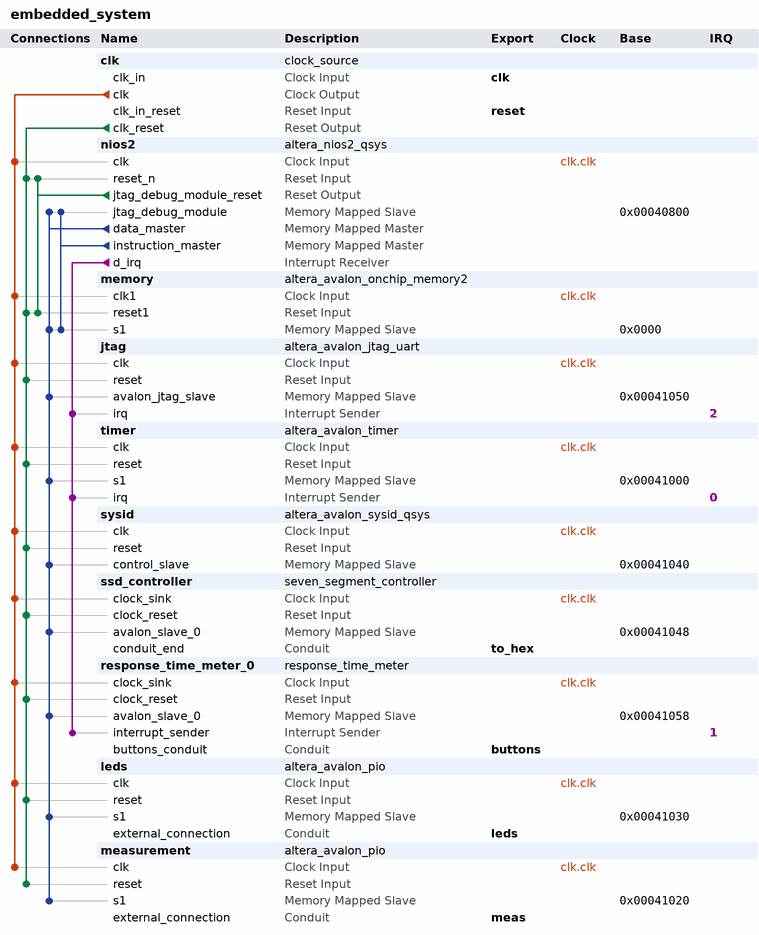
[diagram p0: system contents]
# Platform Designer (Qsys) system embedded_system, Cyclone V 5CSEMA5F31C6
# Parameters at their usual value, and those the tool derives, are not listed.
package require -exact qsys 18.1
create_system embedded_system
set_project_property DEVICE_FAMILY {Cyclone V}
set_project_property DEVICE 5CSEMA5F31C6

add_instance clk clock_source 18.1
set_instance_parameter_value clk clockFrequency 50000000

add_instance nios2 altera_nios2_qsys 16.1
set_instance_parameter_value nios2 breakSlave nios2.jtag_debug_module
set_instance_parameter_value nios2 exceptionSlave memory.s1
set_instance_parameter_value nios2 icache_size 4096
set_instance_parameter_value nios2 impl Tiny
set_instance_parameter_value nios2 mmu_TLBMissExcSlave None
set_instance_parameter_value nios2 resetSlave memory.s1
set_instance_parameter_value nios2 resetrequest_enabled true

add_instance memory altera_avalon_onchip_memory2 18.1
set_instance_parameter_value memory dataWidth 32
set_instance_parameter_value memory dualPort false
set_instance_parameter_value memory initMemContent true
set_instance_parameter_value memory initializationFileName onchip_mem.hex
set_instance_parameter_value memory memorySize 196608

add_instance jtag altera_avalon_jtag_uart 18.1
set_instance_parameter_value jtag simInteractiveOptions NO_INTERACTIVE_WINDOWS

add_instance timer altera_avalon_timer 18.1
set_instance_parameter_value timer alwaysRun true
set_instance_parameter_value timer fixedPeriod true
set_instance_parameter_value timer period 1
set_instance_parameter_value timer periodUnits MSEC
set_instance_parameter_value timer snapshot false

add_instance sysid altera_avalon_sysid_qsys 18.1
set_instance_parameter_value sysid id 19088743

add_instance ssd_controller seven_segment_controller 1.0

add_instance response_time_meter_0 response_time_meter 1.0

add_instance leds altera_avalon_pio 18.1
set_instance_parameter_value leds direction Output
set_instance_parameter_value leds width 10

add_instance measurement altera_avalon_pio 18.1
set_instance_parameter_value measurement direction Output
set_instance_parameter_value measurement width 10

# connections
add_connection clk.clk jtag.clk clock
add_connection clk.clk leds.clk clock
add_connection clk.clk measurement.clk clock
add_connection clk.clk memory.clk1 clock
add_connection clk.clk nios2.clk clock
add_connection clk.clk response_time_meter_0.clock_sink clock
add_connection clk.clk ssd_controller.clock_sink clock
add_connection clk.clk sysid.clk clock
add_connection clk.clk timer.clk clock
add_connection clk.clk_reset jtag.reset reset
add_connection clk.clk_reset leds.reset reset
add_connection clk.clk_reset measurement.reset reset
add_connection clk.clk_reset memory.reset1 reset
add_connection clk.clk_reset nios2.reset_n reset
add_connection clk.clk_reset response_time_meter_0.clock_reset reset
add_connection clk.clk_reset ssd_controller.clock_reset reset
add_connection clk.clk_reset sysid.reset reset
add_connection clk.clk_reset timer.reset reset
add_connection nios2.jtag_debug_module_reset memory.reset1 reset
add_connection nios2.jtag_debug_module_reset nios2.reset_n reset
add_connection nios2.data_master jtag.avalon_jtag_slave avalon
set_connection_parameter_value nios2.data_master/jtag.avalon_jtag_slave baseAddress 0x00041050
add_connection nios2.data_master leds.s1 avalon
set_connection_parameter_value nios2.data_master/leds.s1 baseAddress 0x00041030
add_connection nios2.data_master measurement.s1 avalon
set_connection_parameter_value nios2.data_master/measurement.s1 baseAddress 0x00041020
add_connection nios2.data_master memory.s1 avalon
set_connection_parameter_value nios2.data_master/memory.s1 baseAddress 0x0000
add_connection nios2.data_master nios2.jtag_debug_module avalon
set_connection_parameter_value nios2.data_master/nios2.jtag_debug_module baseAddress 0x00040800
add_connection nios2.data_master response_time_meter_0.avalon_slave_0 avalon
set_connection_parameter_value nios2.data_master/response_time_meter_0.avalon_slave_0 baseAddress 0x00041058
add_connection nios2.data_master ssd_controller.avalon_slave_0 avalon
set_connection_parameter_value nios2.data_master/ssd_controller.avalon_slave_0 baseAddress 0x00041048
add_connection nios2.data_master sysid.control_slave avalon
set_connection_parameter_value nios2.data_master/sysid.control_slave baseAddress 0x00041040
add_connection nios2.data_master timer.s1 avalon
set_connection_parameter_value nios2.data_master/timer.s1 baseAddress 0x00041000
add_connection nios2.instruction_master memory.s1 avalon
set_connection_parameter_value nios2.instruction_master/memory.s1 baseAddress 0x0000
add_connection nios2.instruction_master nios2.jtag_debug_module avalon
set_connection_parameter_value nios2.instruction_master/nios2.jtag_debug_module baseAddress 0x00040800
add_connection nios2.d_irq jtag.irq interrupt
set_connection_parameter_value nios2.d_irq/jtag.irq irqNumber 2
add_connection nios2.d_irq response_time_meter_0.interrupt_sender interrupt
set_connection_parameter_value nios2.d_irq/response_time_meter_0.interrupt_sender irqNumber 1
add_connection nios2.d_irq timer.irq interrupt
set_connection_parameter_value nios2.d_irq/timer.irq irqNumber 0

# exported interfaces
add_interface buttons conduit end
set_interface_property buttons EXPORT_OF response_time_meter_0.buttons_conduit
add_interface clk clock sink
set_interface_property clk EXPORT_OF clk.clk_in
add_interface leds conduit end
set_interface_property leds EXPORT_OF leds.external_connection
add_interface meas conduit end
set_interface_property meas EXPORT_OF measurement.external_connection
add_interface reset reset sink
set_interface_property reset EXPORT_OF clk.clk_in_reset
add_interface to_hex conduit end
set_interface_property to_hex EXPORT_OF ssd_controller.conduit_end

set_interconnect_requirement {$system} qsys_mm.clockCrossingAdapter HANDSHAKE
set_interconnect_requirement {$system} qsys_mm.enableEccProtection FALSE
set_interconnect_requirement {$system} qsys_mm.insertDefaultSlave FALSE
set_interconnect_requirement {$system} qsys_mm.maxAdditionalLatency 1

save_system embedded_system.qsys
